# EAGLE design Dark_Meteors (EAGLE 9.6.2)
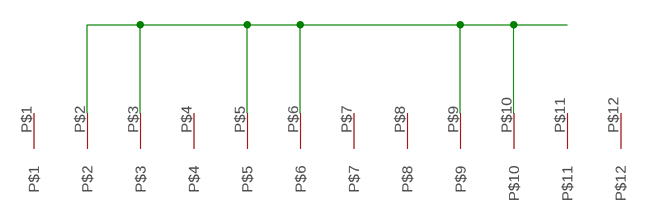
[diagram p0: schematic, sheet 1]

## Parts
U$1  BEAST  [BEAST]

## Nets
N$1: U$1.P$2 U$1.P$3 U$1.P$5 U$1.P$6 U$1.P$9 U$1.P$10
Unconnected: U$1.P$1 U$1.P$4 U$1.P$7 U$1.P$8 U$1.P$11 U$1.P$12

## Library data of the parts
U$1 = beastpins:BEAST

## Board
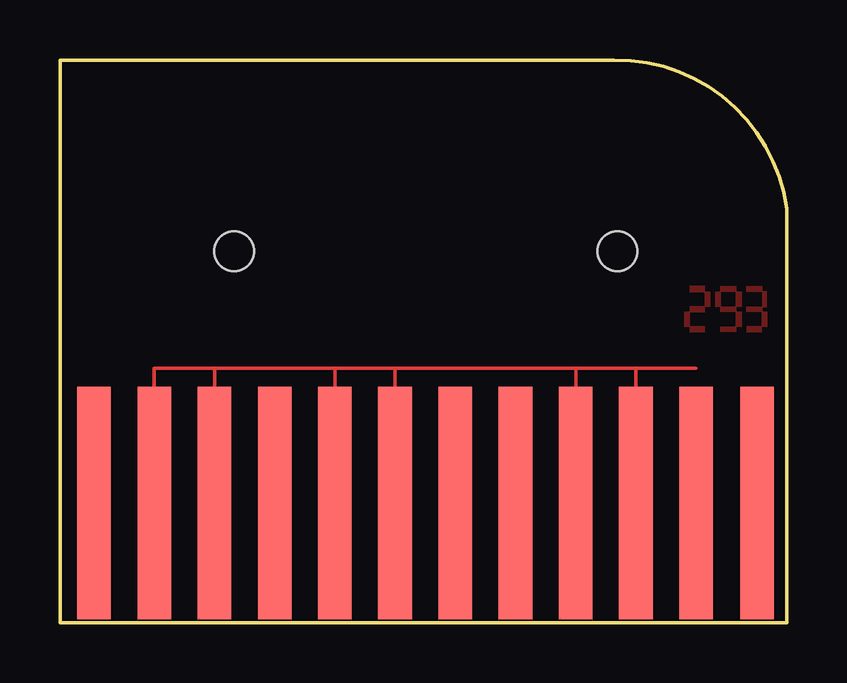
[diagram p1: board, top side]

Size 30.3 x 23.45 mm. Coordinates in mm from the lower left corner, seen from the top.
Outline: 0,0 30.3,0 30.3,17.25 arc83 23.1,23.45 0,23.45 0,0
Copper layers (1*16): Top 0.035mm / dielectric 1.5mm / Bottom 0.035mm
Design rules "default *": minimum track width 6mil, minimum drill 0.35mm, track to track 1mil, track to pad 6mil, pad to pad 6mil, via to via 6mil, smd to smd 6mil, copper to edge 0.002540625mm, drill to drill 1mil, minimum pad ring 10mil, minimum via ring 8mil, stop-mask expansion 4mil, vias tented up to drill 0mil, thermal gap 10mil
Holes 1.65 mm at 7.27,15.49 23.23,15.49

### Footprints (pad centres in the part's own frame; a part is rotated, then mirrored left to right if it is on the bottom)
BEAST = smd 1.4 x 9.7: P$1 -27.61,5.02; P$2 -25.1,5.02; P$3 -22.59,5.02; P$4 -20.08,5.02; P$5 -17.57,5.02; P$6 -15.06,5.02; P$7 -12.55,5.02; P$8 -10.04,5.02; P$9 -7.53,5.02; P$10 -5.02,5.02; P$11 -2.51,5.02; P$12 0.03,5.02

### Placement (x,y rotation side)
U$1  29.03,-0.03 0 top

### Tracks (layer width: path | path; a pad name or v marks a point on that pad's centre or on a via)
N$1
  Top 0.152: 6.45,10.6 3.93,10.6 U$1.P$2 | 6.45,10.6 11.49,10.6 | 11.49,10.6 14.01,10.6 | 14.01,10.6 21.48,10.6 | 21.48,10.6 24.04,10.6 | 24.04,10.6 26.52,10.6 | U$1.P$3 6.44,10.59 6.45,10.6 | U$1.P$5 11.46,10.57 11.49,10.6 | U$1.P$6 13.97,10.56 14.01,10.6 | U$1.P$9 21.5,10.58 21.48,10.6 | U$1.P$10 24.01,10.57 24.04,10.6
N$2
  pour Top: 27.1,13.17 26.9,13.17 26.9,13.8 27.1,13.8
N$3
  pour Top: 26.26,13.17 26.26,12.96 26.89,12.96 26.89,13.17
N$4
  pour Top: 26.26,12.33 26.26,12.12 26.89,12.12 26.89,12.33
N$5
  pour Top: 26.24,12.33 26.05,12.33 26.05,12.96 26.24,12.96
N$6
  pour Top: 28.19,13.8 27.55,13.8 27.55,14.01 28.19,14.01
N$7
  pour Top: 28.4,13.17 28.2,13.17 28.2,13.8 28.4,13.8
N$8
  pour Top: 28.19,12.96 27.55,12.96 27.55,13.17 28.19,13.17
N$9
  pour Top: 28.19,12.12 27.55,12.12 27.55,12.33 28.19,12.33
N$10
  pour Top: 29.28,13.8 29.28,13.17 29.48,13.17 29.48,13.8
N$11
  pour Top: 29.27,12.96 28.64,12.96 28.64,13.17 29.27,13.17
N$12
  pour Top: 28.64,12.33 28.64,12.12 29.27,12.12 29.27,12.33
N$13
  pour Top: 29.48,12.33 29.28,12.33 29.28,12.96 29.48,12.96
N$14
  pour Top: 26.26,14.01 26.26,13.8 26.89,13.8 26.89,14.01
N$15
  pour Top: 28.4,12.33 28.2,12.33 28.2,12.96 28.4,12.96
N$26
  pour Top: 27.54,13.17 27.34,13.17 27.34,13.8 27.54,13.8
N$35
  pour Top: 29.27,13.8 28.64,13.8 28.64,14.01 29.27,14.01